# Altium schematic sheet SubBus2.SchDoc
size A
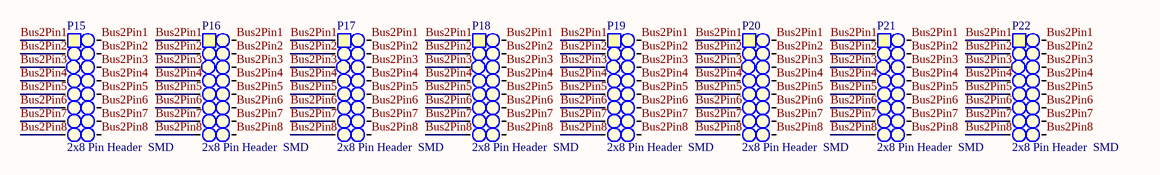
[diagram p0: SubBus2.SchDoc]

## Parts
P15  2x8 Pin Header  SMD  [2X8_SMD_PH_2.54]
P16  2x8 Pin Header  SMD  [2X8_SMD_PH_2.54]
P17  2x8 Pin Header  SMD  [2X8_SMD_PH_2.54]
P18  2x8 Pin Header  SMD  [2X8_SMD_PH_2.54]
P19  2x8 Pin Header  SMD  [2X8_SMD_PH_2.54]
P20  2x8 Pin Header  SMD  [2X8_SMD_PH_2.54]
P21  2x8 Pin Header  SMD  [2X8_SMD_PH_2.54]
P22  2x8 Pin Header  SMD  [2X8_SMD_PH_2.54]

## Nets
Bus2Pin1: P15.1 P15.16 P16.1 P16.16 P17.1 P17.16 P18.1 P18.16 P19.1 P19.16 P20.1 P20.16 P21.1 P21.16 P22.1 P22.16
Bus2Pin2: P15.2 P15.15 P16.2 P16.15 P17.2 P17.15 P18.2 P18.15 P19.2 P19.15 P20.2 P20.15 P21.2 P21.15 P22.2 P22.15
Bus2Pin3: P15.3 P15.14 P16.3 P16.14 P17.3 P17.14 P18.3 P18.14 P19.3 P19.14 P20.3 P20.14 P21.3 P21.14 P22.3 P22.14
Bus2Pin4: P15.4 P15.13 P16.4 P16.13 P17.4 P17.13 P18.4 P18.13 P19.4 P19.13 P20.4 P20.13 P21.4 P21.13 P22.4 P22.13
Bus2Pin5: P15.5 P15.12 P16.5 P16.12 P17.5 P17.12 P18.5 P18.12 P19.5 P19.12 P20.5 P20.12 P21.5 P21.12 P22.5 P22.12
Bus2Pin6: P15.6 P15.11 P16.6 P16.11 P17.6 P17.11 P18.6 P18.11 P19.6 P19.11 P20.6 P20.11 P21.6 P21.11 P22.6 P22.11
Bus2Pin7: P15.7 P15.10 P16.7 P16.10 P17.7 P17.10 P18.7 P18.10 P19.7 P19.10 P20.7 P20.10 P21.7 P21.10 P22.7 P22.10
Bus2Pin8: P15.8 P15.9 P16.8 P16.9 P17.8 P17.9 P18.8 P18.9 P19.8 P19.9 P20.8 P20.9 P21.8 P21.9 P22.8 P22.9

## Library data of the parts
P15-P22 = 2x8 Pin Header  SMD: 2.54mm, SMD; Value: 2x8 Pin Header, 2.54mm, SMD; Farnell: 2356242